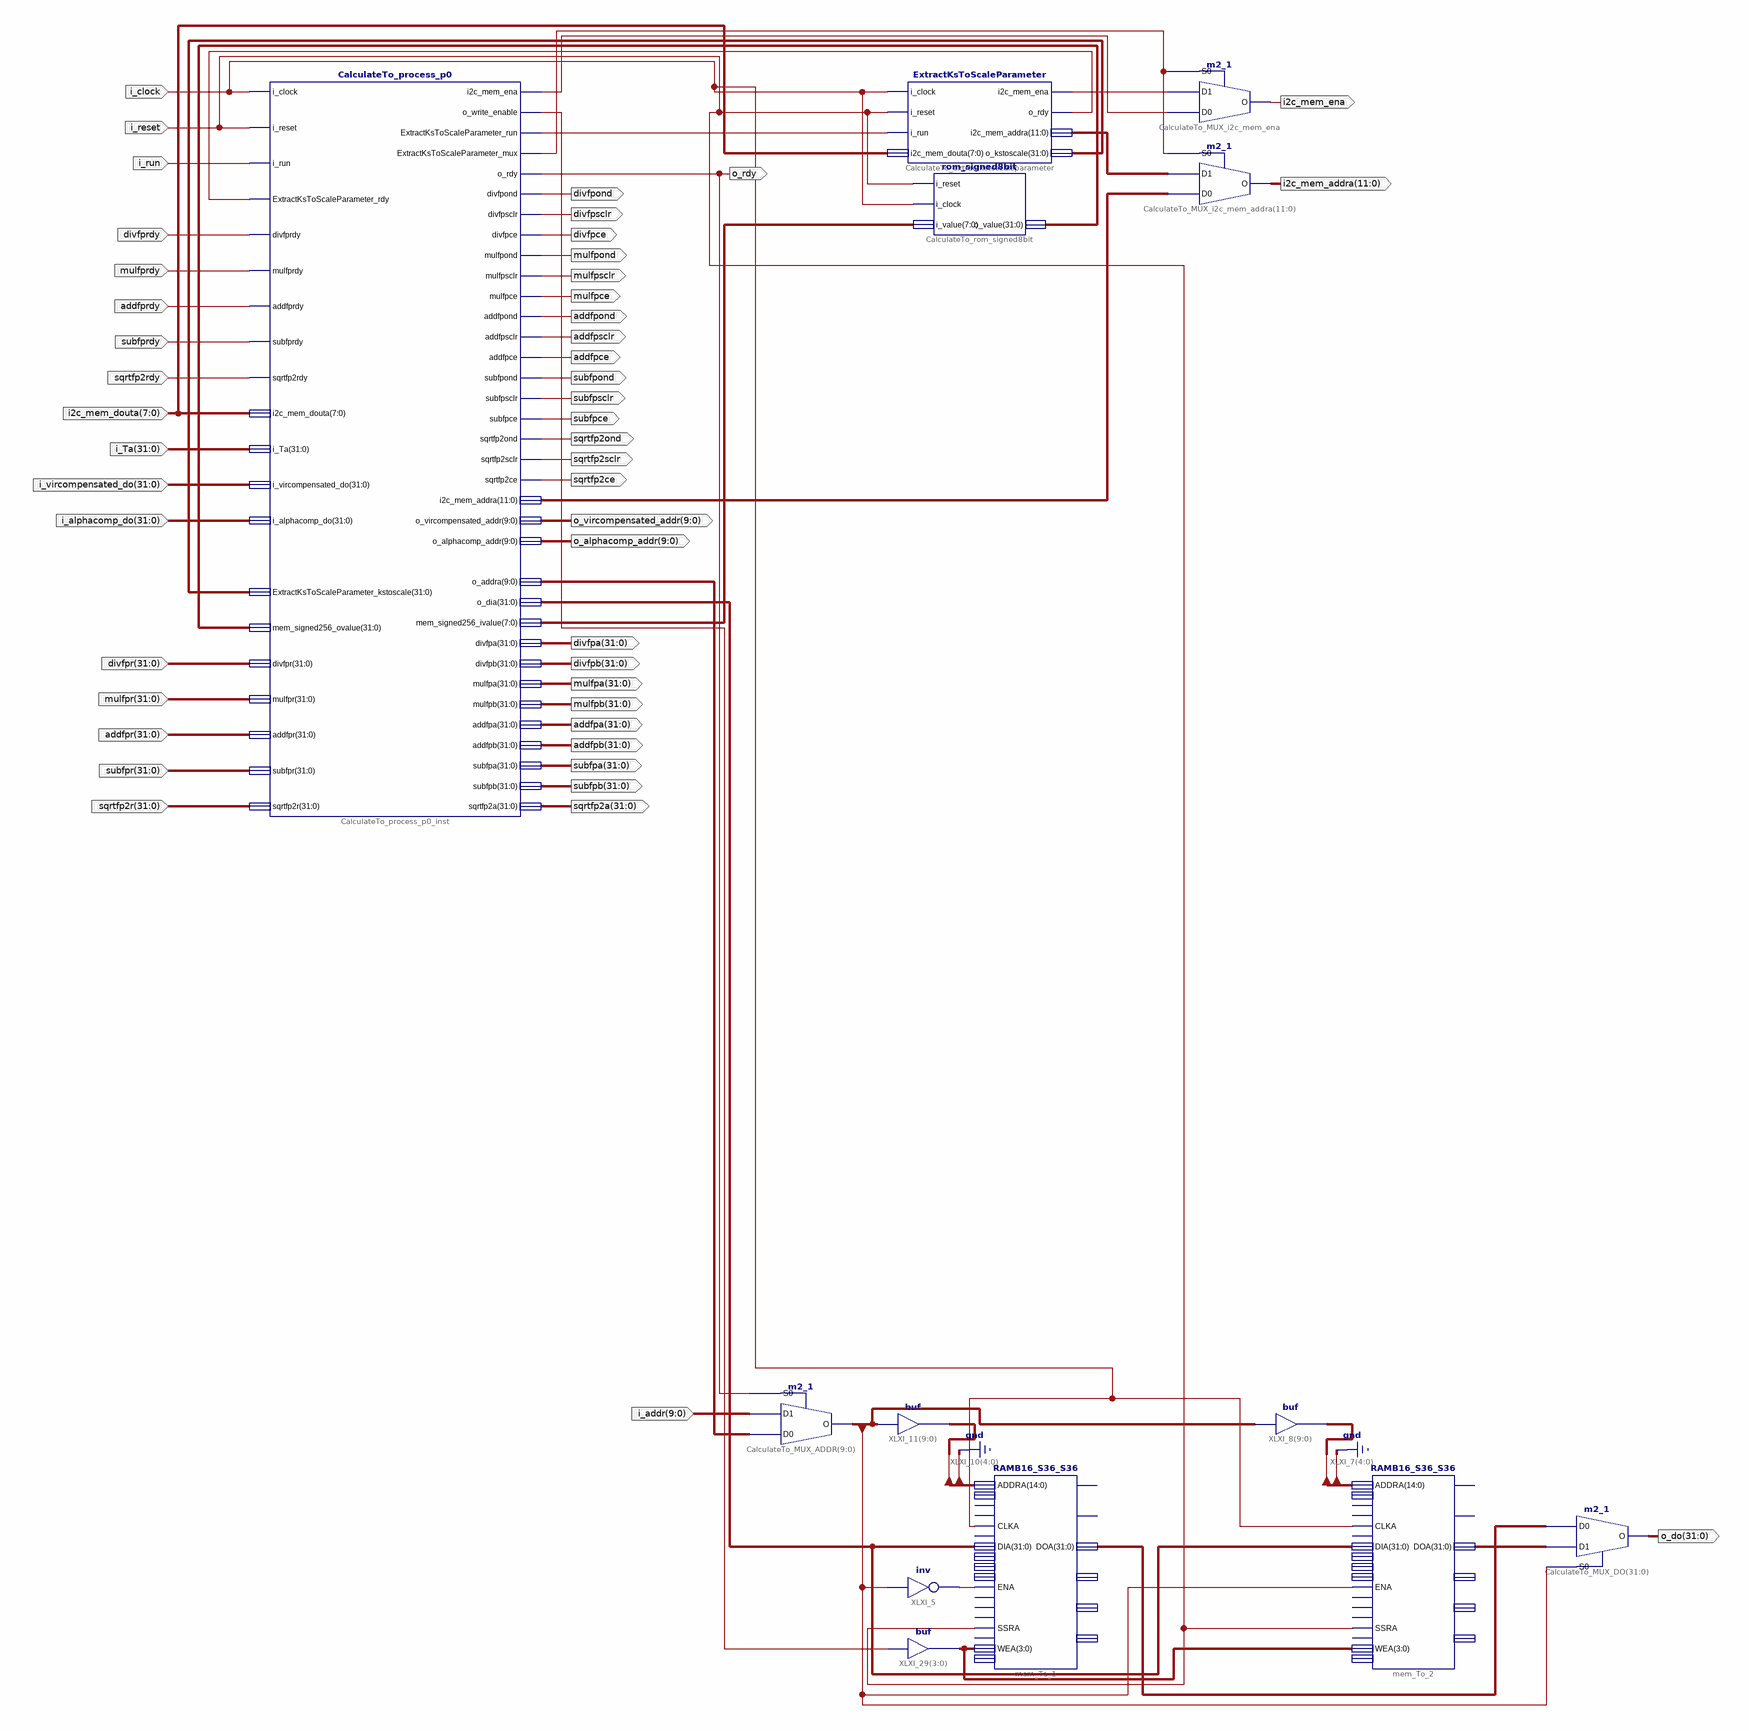
[diagram p0: schematic sheet 1]
// Xilinx ISE schematic CalculateTo.sch (spartan3e) as structural Verilog: 13 symbols, 48 ports
module CalculateTo (
  input  [9:0] i_addr,
  input  i_clock,
  input  i_reset,
  input  [7:0] i2c_mem_douta,
  input  [31:0] sqrtfp2r,
  input  [31:0] subfpr,
  input  [31:0] addfpr,
  input  [31:0] mulfpr,
  input  [31:0] divfpr,
  input  [31:0] i_alphacomp_do,
  input  [31:0] i_vircompensated_do,
  input  [31:0] i_Ta,
  input  sqrtfp2rdy,
  input  subfprdy,
  input  addfprdy,
  input  mulfprdy,
  input  divfprdy,
  input  i_run,
  output [31:0] o_do,
  output o_rdy,
  output i2c_mem_ena,
  output [11:0] i2c_mem_addra,
  output divfpond,
  output divfpsclr,
  output divfpce,
  output mulfpond,
  output mulfpsclr,
  output mulfpce,
  output addfpond,
  output addfpsclr,
  output addfpce,
  output subfpond,
  output subfpsclr,
  output subfpce,
  output sqrtfp2ond,
  output sqrtfp2sclr,
  output sqrtfp2ce,
  output [9:0] o_vircompensated_addr,
  output [9:0] o_alphacomp_addr,
  output [31:0] divfpa,
  output [31:0] divfpb,
  output [31:0] mulfpa,
  output [31:0] mulfpb,
  output [31:0] addfpa,
  output [31:0] addfpb,
  output [31:0] subfpa,
  output [31:0] subfpb,
  output [31:0] sqrtfp2a
);

  wire XLXN_59, XLXN_269, XLXN_270, XLXN_278, XLXN_279, XLXN_282, XLXN_288;
  wire [3:0] XLXN_139;
  wire [7:0] XLXN_275;
  wire [9:0] mux_addr1, XLXN_241;
  wire [11:0] XLXN_280, XLXN_281;
  wire [14:5] XLXN_44, XLXN_45;
  wire [31:0] XLXN_78, XLXN_79, XLXN_239, XLXN_276, XLXN_277;

  CalculateTo_process_p0 CalculateTo_process_p0_inst (
    .i_clock(i_clock), .i_reset(i_reset), .i_run(i_run), .ExtractKsToScaleParameter_rdy(XLXN_269),
    .divfprdy(divfprdy), .mulfprdy(mulfprdy), .addfprdy(addfprdy), .subfprdy(subfprdy),
    .sqrtfp2rdy(sqrtfp2rdy), .i2c_mem_douta(i2c_mem_douta), .i_Ta(i_Ta),
    .i_vircompensated_do(i_vircompensated_do), .i_alphacomp_do(i_alphacomp_do),
    .ExtractKsToScaleParameter_kstoscale(XLXN_277), .mem_signed256_ovalue(XLXN_276), .divfpr(divfpr),
    .mulfpr(mulfpr), .addfpr(addfpr), .subfpr(subfpr), .sqrtfp2r(sqrtfp2r), .i2c_mem_ena(XLXN_279),
    .o_write_enable(XLXN_288), .ExtractKsToScaleParameter_run(XLXN_270),
    .ExtractKsToScaleParameter_mux(XLXN_282), .o_rdy(o_rdy), .divfpond(divfpond), .divfpsclr(divfpsclr),
    .divfpce(divfpce), .mulfpond(mulfpond), .mulfpsclr(mulfpsclr), .mulfpce(mulfpce), .addfpond(addfpond),
    .addfpsclr(addfpsclr), .addfpce(addfpce), .subfpond(subfpond), .subfpsclr(subfpsclr), .subfpce(subfpce),
    .sqrtfp2ond(sqrtfp2ond), .sqrtfp2sclr(sqrtfp2sclr), .sqrtfp2ce(sqrtfp2ce), .i2c_mem_addra(XLXN_281),
    .o_vircompensated_addr(o_vircompensated_addr), .o_alphacomp_addr(o_alphacomp_addr), .o_addra(XLXN_241),
    .o_dia(XLXN_239), .mem_signed256_ivalue(XLXN_275), .divfpa(divfpa), .divfpb(divfpb), .mulfpa(mulfpa),
    .mulfpb(mulfpb), .addfpa(addfpa), .addfpb(addfpb), .subfpa(subfpa), .subfpb(subfpb), .sqrtfp2a(sqrtfp2a));
  assign XLXN_45 = mux_addr1;  // buf XLXI_8[9..0], 10 bits wide
  assign XLXN_44 = mux_addr1;  // buf XLXI_11[9..0], 10 bits wide
  not XLXI_5 (XLXN_59, mux_addr1[9]);
  RAMB16_S36_S36 #(.WRITE_WIDTH_B(36), .WRITE_WIDTH_A(36), .WRITE_MODE_B("READ_FIRST"), .WRITE_MODE_A("READ_FIRST"), .READ_WIDTH_B(36), .READ_WIDTH_A(36)) mem_To_1 (
    .ADDRA({XLXN_44, {5{1'b0}}}), .CLKA(i_clock), .DIA(XLXN_239), .ENA(XLXN_59), .SSRA(i_reset),
    .WEA(XLXN_139), .DOA(XLXN_79));  // open: ADDRB, CASCADEINA, CASCADEINB, CLKB, DIB, DIPA, DIPB, REGCEA, REGCEB, ENB, SSRB, WEB, CASCADEOUTA, CASCADEOUTB, DOB, DOPA, DOPB
  m2_1 CalculateTo_MUX_DO[31:0] (.D0(XLXN_79), .D1(XLXN_78), .S0(mux_addr1[9]), .O(o_do));
  assign XLXN_139 = {4{XLXN_288}};  // buf XLXI_29[3..0], 4 bits wide
  m2_1 CalculateTo_MUX_ADDR[9:0] (.D0(XLXN_241), .D1(i_addr), .S0(o_rdy), .O(mux_addr1));
  RAMB16_S36_S36 #(.WRITE_WIDTH_B(36), .WRITE_WIDTH_A(36), .WRITE_MODE_B("READ_FIRST"), .WRITE_MODE_A("READ_FIRST"), .READ_WIDTH_B(36), .READ_WIDTH_A(36)) mem_To_2 (
    .ADDRA({XLXN_45, {5{1'b0}}}), .CLKA(i_clock), .DIA(XLXN_239), .ENA(mux_addr1[9]), .SSRA(i_reset),
    .WEA(XLXN_139), .DOA(XLXN_78));  // open: ADDRB, CASCADEINA, CASCADEINB, CLKB, DIB, DIPA, DIPB, REGCEA, REGCEB, ENB, SSRB, WEB, CASCADEOUTA, CASCADEOUTB, DOB, DOPA, DOPB
  ExtractKsToScaleParameter CalculateTo_extractkstoscaleparameter (
    .i_clock(i_clock), .i_reset(i_reset), .i_run(XLXN_270), .i2c_mem_douta(i2c_mem_douta),
    .i2c_mem_ena(XLXN_278), .o_rdy(XLXN_269), .i2c_mem_addra(XLXN_280), .o_kstoscale(XLXN_277));
  rom_signed8bit CalculateTo_rom_signed8bit (
    .i_value(XLXN_275), .i_clock(i_clock), .i_reset(i_reset), .o_value(XLXN_276));
  m2_1 CalculateTo_MUX_i2c_mem_ena (.D0(XLXN_279), .D1(XLXN_278), .S0(XLXN_282), .O(i2c_mem_ena));
  m2_1 CalculateTo_MUX_i2c_mem_addra[11:0] (.D0(XLXN_281), .D1(XLXN_280), .S0(XLXN_282), .O(i2c_mem_addra));
endmodule
